# Altium project QUT_Autopilot_Pixracer.PrjPcb (part 2 of 2)

## Sheet pixracer_serials.SchDoc
size A4; SheetNumber: 4; SheetTotal: 5
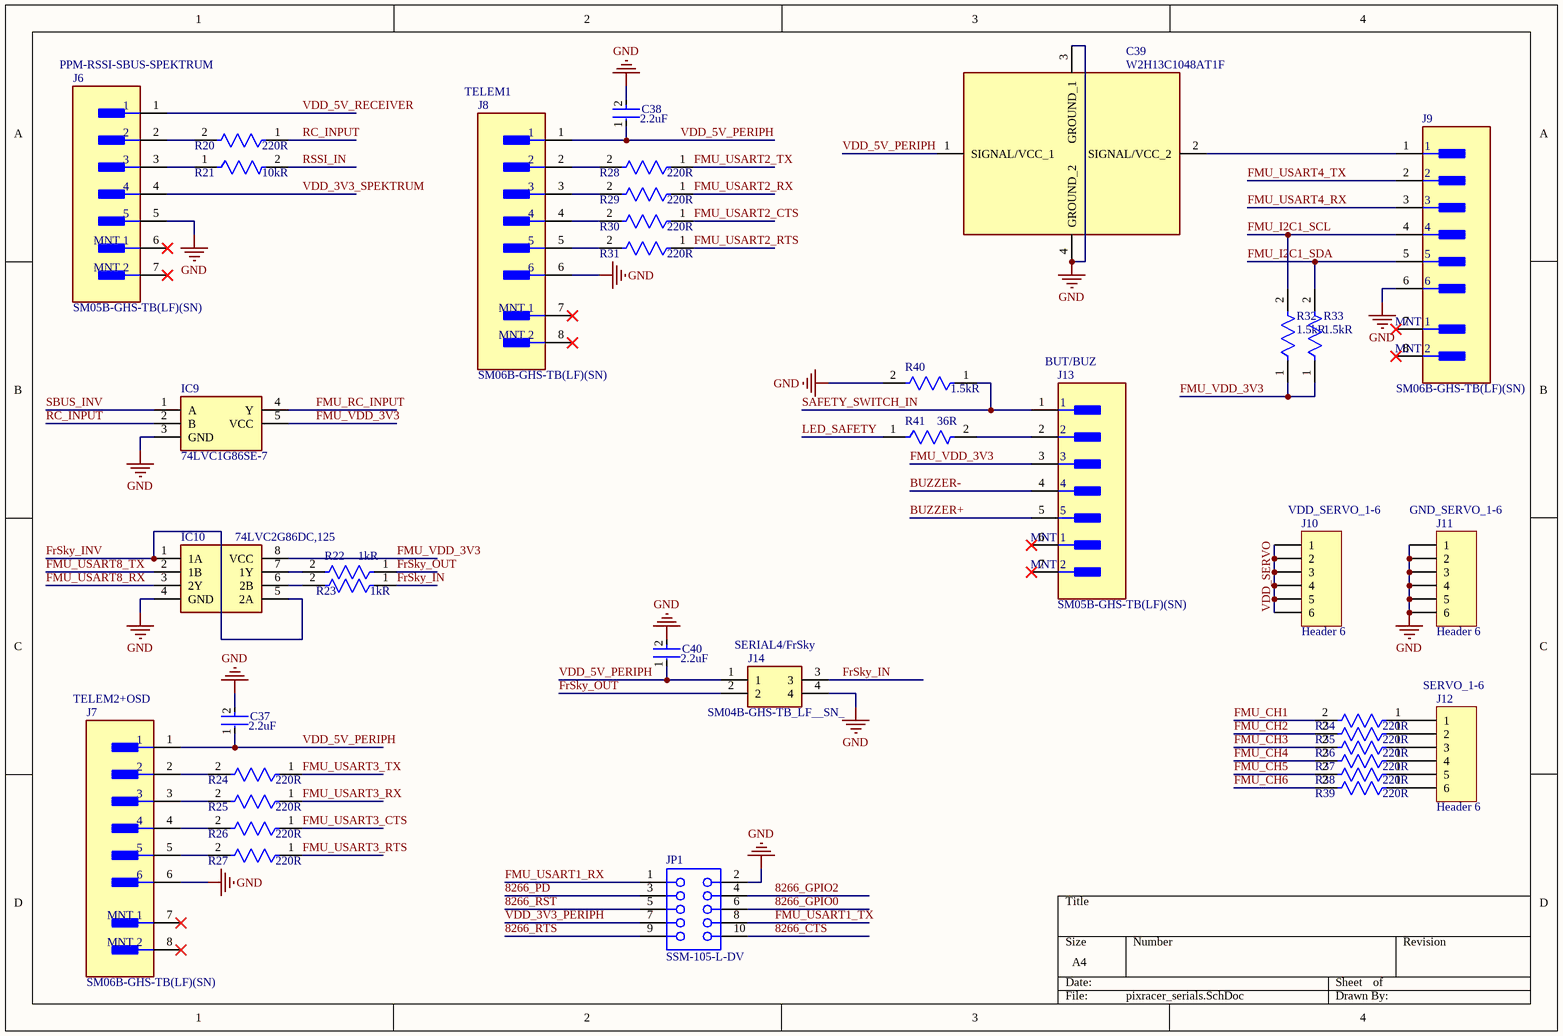
[diagram p3: pixracer_serials.SchDoc]

### Parts
C37  Capacitance: 2.2uF  [FP-C1608-080-0_1-MFG]  (hidden comment: C1608X7R1A225K080AC)
C38  Capacitance: 2.2uF  [FP-C1608-080-0_1-MFG]  (hidden comment: C1608X7R1A225K080AC)
C39  W2H13C1048AT1F  [W2H13C1048AT1A]
C40  Capacitance: 2.2uF  [FP-C1608-080-0_1-MFG]  (hidden comment: C1608X7R1A225K080AC)
IC9  74LVC1G86SE-7  [SOT65P210X110-5N]
IC10  74LVC2G86DC,125  [SOP50P310X100-8N]
J6  SM05B-GHS-TB(LF)(SN)  [FP-SM05B-GHS-TB_LF_SN-MFG]
J7  SM06B-GHS-TB(LF)(SN)  [FP-SM06B-GHS-TB_LF_SN-MFG]
J8  SM06B-GHS-TB(LF)(SN)  [FP-SM06B-GHS-TB_LF_SN-MFG]
J9  SM06B-GHS-TB(LF)(SN)  [FP-SM06B-GHS-TB_LF_SN-MFG]
J10  Header 6  [HDR1X6]
J11  Header 6  [HDR1X6]
J12  Header 6  [HDR1X6]
J13  SM05B-GHS-TB(LF)(SN)  [FP-SM05B-GHS-TB_LF_SN-MFG]
J14  SM04B-GHS-TB_LF__SN_  [SM04B-GHS-TB]
JP1  SSM-105-L-DV  [SMTC-SSM-105-X-DV]
R20  Resistance: 220R  [FP-CRCW0603-e3-MFG]  (hidden comment: CRCW0603220RFKEB)
R21  Resistance: 10kR  [FP-ERJ3G-IPC_C]  (hidden comment: ERJ-3GEYJ103V)
R22  Resistance: 1kR  [FP-RC1608-IPC_A]  (hidden comment: RC1608J102CS)
R23  Resistance: 1kR  [FP-RC1608-IPC_A]  (hidden comment: RC1608J102CS)
R24  Resistance: 220R  [FP-CRCW0603-e3-MFG]  (hidden comment: CRCW0603220RFKEB)
R25  Resistance: 220R  [FP-CRCW0603-e3-MFG]  (hidden comment: CRCW0603220RFKEB)
R26  Resistance: 220R  [FP-CRCW0603-e3-MFG]  (hidden comment: CRCW0603220RFKEB)
R27  Resistance: 220R  [FP-CRCW0603-e3-MFG]  (hidden comment: CRCW0603220RFKEB)
R28  Resistance: 220R  [FP-CRCW0603-e3-MFG]  (hidden comment: CRCW0603220RFKEB)
R29  Resistance: 220R  [FP-CRCW0603-e3-MFG]  (hidden comment: CRCW0603220RFKEB)
R30  Resistance: 220R  [FP-CRCW0603-e3-MFG]  (hidden comment: CRCW0603220RFKEB)
R31  Resistance: 220R  [FP-CRCW0603-e3-MFG]  (hidden comment: CRCW0603220RFKEB)
R32  value 1.5kR  [FP-CPF0603-MFG]  (hidden comment: CPF0603B1K5E1)
R33  value 1.5kR  [FP-CPF0603-MFG]  (hidden comment: CPF0603B1K5E1)
R34  Resistance: 220R  [FP-CRCW0603-e3-MFG]  (hidden comment: CRCW0603220RFKEB)
R35  Resistance: 220R  [FP-CRCW0603-e3-MFG]  (hidden comment: CRCW0603220RFKEB)
R36  Resistance: 220R  [FP-CRCW0603-e3-MFG]  (hidden comment: CRCW0603220RFKEB)
R37  Resistance: 220R  [FP-CRCW0603-e3-MFG]  (hidden comment: CRCW0603220RFKEB)
R38  Resistance: 220R  [FP-CRCW0603-e3-MFG]  (hidden comment: CRCW0603220RFKEB)
R39  Resistance: 220R  [FP-CRCW0603-e3-MFG]  (hidden comment: CRCW0603220RFKEB)
R40  Resistance: 1.5kR  [FP-MCR03-IPC_A]  (hidden comment: MCR03EZPFX1501)
R41  Resistance: 36R  [FP-CRCW0603-e3-IPC_B]  (hidden comment: CRCW060336R0JNEA)

### Nets
GND: C37.2 C38.2 C39.3(GROUND_1) C39.4(GROUND_2) C40.2 IC9.3(GND) IC10.4(GND) J6.5 J7.6 J8.6 J9.6 J11.1 J11.2 J11.3 J11.4 J11.5 J11.6 J14.4 JP1.2 R40.2
8266_CTS: JP1.10
8266_GPIO0: JP1.6
8266_GPIO2: JP1.4
8266_PD: JP1.3
8266_RST: JP1.5
8266_RTS: JP1.9
BUZZER+: J13.5
BUZZER-: J13.4
FMU_CH1: R34.2
FMU_CH2: R35.2
FMU_CH3: R36.2
FMU_CH4: R37.2
FMU_CH5: R38.2
FMU_CH6: R39.2
FMU_I2C1_SCL: J9.4 R32.2
FMU_I2C1_SDA: J9.5 R33.2
FMU_RC_INPUT: IC9.4(Y)
FMU_USART1_RX: JP1.1
FMU_USART1_TX: JP1.8
FMU_USART2_CTS: R30.1
FMU_USART2_RTS: R31.1
FMU_USART2_RX: R29.1
FMU_USART2_TX: R28.1
FMU_USART3_CTS: R26.1
FMU_USART3_RTS: R27.1
FMU_USART3_RX: R25.1
FMU_USART3_TX: R24.1
FMU_USART4_RX: J9.3
FMU_USART4_TX: J9.2
FMU_USART8_RX: IC10.3(2Y)
FMU_USART8_TX: IC10.2(1B)
FMU_VDD_3V3: IC9.5(VCC) IC10.8(VCC) J13.3 R32.1 R33.1
FrSky_IN: J14.3 R23.1
FrSky_INV: IC10.1(1A) IC10.5(2A)
FrSky_OUT: J14.2 R22.1
LED_SAFETY: R41.1
RC_INPUT: IC9.2(B) R20.1
RSSI_IN: R21.2
SAFETY_SWITCH_IN: J13.1 R40.1
SBUS_INV: IC9.1(A)
VDD_3V3_PERIPH: JP1.7
VDD_3V3_SPEKTRUM: J6.4
VDD_5V_PERIPH: C37.1 C38.1 C39.1(SIGNAL/VCC_1) C40.1 J7.1 J8.1 J14.1
VDD_5V_RECEIVER: J6.1
VDD_SERVO: J10.1 J10.2 J10.3 J10.4 J10.5 J10.6
NetC39_2: C39.2(SIGNAL/VCC_2) J9.1
NetIC10_6: IC10.6(2B) R23.2
NetIC10_7: IC10.7(1Y) R22.2
NetJ6_2: J6.2 R20.2
NetJ6_3: J6.3 R21.1
NetJ7_2: J7.2 R24.2
NetJ7_3: J7.3 R25.2
NetJ7_4: J7.4 R26.2
NetJ7_5: J7.5 R27.2
NetJ8_2: J8.2 R28.2
NetJ8_3: J8.3 R29.2
NetJ8_4: J8.4 R30.2
NetJ8_5: J8.5 R31.2
NetJ12_1: J12.1 R34.1
NetJ12_2: J12.2 R35.1
NetJ12_3: J12.3 R36.1
NetJ12_4: J12.4 R37.1
NetJ12_5: J12.5 R38.1
NetJ12_6: J12.6 R39.1
NetJ13_2: J13.2 R41.2

Not connected (* = marked no-connect by the designer): J6 6(MNT_1)* 7(MNT_2)*; J7 7(MNT_1)* 8(MNT_2)*; J8 7(MNT_1)* 8(MNT_2)*; J9 7(MNT_1)* 8(MNT_2)*; J13 6(MNT_1)* 7(MNT_2)*

### Notes on the sheet
- (near J6) PPM-RSSI-SBUS-SPEKTRUM
- TELEM1
- (near J13) BUT/BUZ
- (near J10) VDD_SERVO_1-6
- (near J11) GND_SERVO_1-6
- (near J14) SERIAL4/FrSky
- (near J7) TELEM2+OSD
- (near J12) SERVO_1-6

### Library data of the parts
C37 C38 C40 = CMP-08246-006835-1: Multilayer Ceramic Capacitors 2.2μF ±10% 10V X7R SMD 0603; Lead Free: Lead Free; Mount: Surface Mount; Case Code (Metric): 1608; Construction: Flat; Packaging: Tape and Reel; REACH SVHC: No SVHC; Weight: 7.1E-05oz; Resistor Type: Ceramic; Package Quantity: 4000; Voltage Rating (DC): 10V; Case/Package: 0603; Termination: SMD/SMT; Case Code (Imperial): 0603; Series: C; Voltage Rating: 10V; Min Operating Temperature: -55°C; Dielectric Material: Ceramic; Length: 1.6mm; Tolerance: 10%; Depth: 0.8mm; Width: 0.031inch; Dielectric: X7R; Max Operating Temperature: 125°C; RoHS Compliant: Yes; Height: 0.8mm; Thickness: 0.037inch
C39 = W2H13C1048AT1F: Capacitor; Manufacturer_Name: AVX; Datasheet Link: https://componentsearchengine.com/Datasheets/1/W2H13C1048AT1F.pdf; Height: 1mm; Manufacturer_Part_Number: W2H13C1048AT1F; Mouser Part Number: 581-W2H13C1048AT1F; Mouser Price/Stock: https://www.mouser.com/Search/Refine.aspx?Keyword=581-W2H13C1048AT1F; Arrow Part Number: W2H13C1048AT1F; Arrow Price/Stock: https://www.arrow.com/en/products/w2h13c1048at1f/avx
IC9 = 74LVC1G86SE-7: Integrated Circuit; Manufacturer_Name: Diodes Inc.; Datasheet Link: https://www.diodes.com/assets/Datasheets/74LVC1G86.pdf; Height: 1.1mm; Manufacturer_Part_Number: 74LVC1G86SE-7; Mouser Part Number: 621-74LVC1G86SE-7; Mouser Price/Stock: https://www.mouser.co.uk/ProductDetail/Diodes-Incorporated/74LVC1G86SE-7/?qs=8Dv1RiiPiVJ%252BnYSWg3kTgg%3D%3D; Arrow Part Number: 74LVC1G86SE-7; Arrow Price/Stock: https://www.arrow.com/en/products/74lvc1g86se-7/diodes-incorporated?region=nac
IC10 = 74LVC2G86DC,125: Integrated Circuit; Manufacturer_Name: Nexperia; Datasheet Link: https://assets.nexperia.com/documents/data-sheet/74LVC2G86.pdf; Height: 1mm; Manufacturer_Part_Number: 74LVC2G86DC,125; Mouser Part Number: 771-LVC2G86DC125; Mouser Price/Stock: https://www.mouser.co.uk/ProductDetail/Nexperia/74LVC2G86DC125?qs=me8TqzrmIYXbZy3sMRjHUw%3D%3D; Arrow Part Number: 74LVC2G86DC,125; Arrow Price/Stock: https://www.arrow.com/en/products/74lvc2g86dc125/nexperia?region=nac
J6 J13 = CMP-17439-000048-1: CONN HEADER SMD R/A 5POS 1.25MM; Current Rating: 1A; Pitch: 0.049inch; Connector Type: Outer Shroud Contact; Number of Positions: 5; Voltage Rating (AC): 50V; Wire/Cable Gauge: 26AWG; Series: GH; Mount: Surface Mount; Housing Material: Nylon; Contact Type: Outer Shroud Contact; REACH SVHC: No SVHC; Number of Rows: 1; Lead Free: Lead Free; Color: Natural; Contact Material: Bronze; Contact Plating: Tin; Max Operating Temperature: 85°C; Orientation: Right Angle; Number of Contacts: 5; Voltage Rating: 50V; Housing Color: Natural; Termination: Solder; Min Operating Temperature: -25°C; Fastening Type: Ramp; Packaging: Tape and Reel
J7-J9 = CMP-17439-000061-1: CONN HEADER SMD R/A 6POS 1.25MM; Number of Contacts: 6; Voltage Rating: 50V; Current Rating: 1A; Connector Type: Outer Shroud Contact; Contact Resistance: 50mR; Orientation: Right Angle; Max Operating Temperature: 85°C; Mount: Surface Mount; Packaging: Tape and Reel; Contact Plating: Tin; Depth: 4.05mm; Max Voltage Rating (AC): 50V; Lead Free: Lead Free; Pitch: 1.25mm; Number of Positions: 6; Max Current Rating: 1A; Termination: Solder; Min Operating Temperature: -25°C; Housing Color: Beige; Fastening Type: Ramp; Length: 10.75mm; Color: Natural; Contact Material: Bronze; Housing Material: Polyamide; Number of Rows: 1
J10-J12 = Header 6: Header, 6-Pin; LatestRevisionDate: 17-Jul-2002; LatestRevisionNote: Re-released for DXP Platform.; Publisher: Altium Limited
J14 = SM04B-GHS-TB_LF__SN_: Connector; Manufacturer_Name: JST (JAPAN SOLDERLESS TERMINALS); Manufacturer_Part_Number: SM04B-GHS-TB(LF)(SN); Datasheet Link: http://uk.rs-online.com/web/p/products/7521797
JP1 = CMP-1023-00207-1: Tiger Claw(TM) Surface Mount Socket, Vertical, -55 to 125 degC, 2.54 mm Pitch, 10-Pin, Female, RoHS; Manufacturer: Samtec; Pitch: 2.54 mm; PackageReference: SSM-105-X-DV; DatasheetVersion: F-214; ComponentLink2Description: Datasheet; Mounting Technology: Surface Mount; PackageDescription: .100 C.L. Double Vertical SMT Socket Strip; ComponentLink3Description: Package Specification; ComponentLink2URL: http://www.samtec.com/documents/webfiles/pdf/SSM_SM.PDF; ComponentLink1URL: http://www.samtec.com; PackageVersion: AK, 3/2000; Orientation: Vertical; RoHS: True; ComponentLink1Description: Manufacturer URL; PartNumber: SSM-105-L-DV; ComponentLink3URL: http://www.samtec.com/documents/webfiles/cpdf/SSM-1XX-XXX-DV-XX-XX-X-XX-MKT.pdf; Temperature Range: -55 to 125 degC
R20 R24-R31 R34-R39 = CMP-02407-003555-1: RES Thick Film, 220Ω, 1%, 0.1W, 100ppm/°C, 0603; Voltage Rating: 75V; Power Rating: 100mW; Length: 1.55mm; Weight: 7.1E-05oz; Package Quantity: 10000; Case/Package: 0603; Composition: Thick Film; Max Operating Temperature: 155°C; Military Standard: Not; Tolerance: 1%; Lead Free: Lead Free; Number of Terminations: 2; Min Operating Temperature: -55°C; Case Code (Imperial): 0603; Max Power Dissipation: 100mW; Features: Automotive AEC-Q200; Packaging: Tape and Reel; Temperature Coefficient: 100ppm/°C; Case Code (Metric): 1608; Termination: SMD/SMT; Depth: 0.85mm; Height: 0.02inch; Width: 0.85mm
R21 = CMP-2000-00704-2: RES SMD 10K OHM 5% 1/10W 0603; Temperature Coefficient: 200ppm/°C; Max Power Dissipation: 100mW; Voltage Rating (DC): 50V; Voltage Rating: 75V; Resistor Type: Thick Film; Tolerance: 5%; Military Standard: Not; Package Quantity: 1; Max Operating Temperature: 155°C; Mount: Surface Mount; Technology: THICK FILM; Case/Package: 0603; Construction: Rectangular; Depth: 0.8mm; Case Code (Imperial): 0603; Weight: 7.1E-05oz; Features: Automotive AEC-Q200; Packaging: Tape and Reel; Width: 0.8mm; Length: 1.6mm; Termination: SMD/SMT; Power Rating: 100mW; Lead Free: Lead Free; Number of Terminations: 2; Height: 0.45mm; RoHS Compliant: Yes; Min Operating Temperature: -55°C; Contact Plating: Tin; REACH SVHC: No SVHC; Resistance Tolerance: 5%; Series: ERJ; Working Voltage: 75V; Case Code (Metric): 1608
R22 R23 = CMP-13261-002301-1: Res Thick Film 0603 1kΩ 5% 0.1W ±100ppm/°C Molded SMD T/R; Power Rating: 100mW; Voltage Rating (DC): 50V; Contact Plating: Tin; Mount: Surface Mount; Number of Terminations: 2; Features: Moisture Resistant; Max Power Dissipation: 100mW; Military Standard: Not; Case/Package: 0603; Radiation Hardening: No; Temperature Coefficient: 100ppm/°C; Length: 1.6mm; Height: 0.022inch; Case Code (Metric): 1608; Max Operating Temperature: 155°C; Composition: Thick Film; Tolerance: 5%; Width: 0.031inch; Depth: 0.8mm; Packaging: Tape and Reel; Lead Free: Lead Free; Case Code (Imperial): 0603; Min Operating Temperature: -55°C
R32 R33 = CMP-03211-005433-1: RES SMD 1.5KΩ 0.1% 1/16W 0603; Manufacturer: TE Connectivity; Power Rating: 0.063W; Voltage Rating: 50V; Temperature Coefficient: 25ppm/°C; Series: CPF; Temperature Range Low: -55°C; ComponentLink2URL: https://www.te.com/commerce/DocumentDelivery/DDEController?Action=showdoc&DocId=Data+Sheet%7F1773200%7FM%7Fpdf%7FEnglish%7FENG_DS_1773200_M.pdf%7F3-1676481-2; Height: 0.55mm; Lead Free: Yes; Resistance: 1.5KΩ; RoHS: TRUE; Device Class L1: Passive Components; Manufacturer Part Number: CPF0603B1K5E1; Octopart: https://octopart.com/cpf0603b1k5e1-te+connectivity-9539421; Package: CPF0603; Device Class L3: Chip SMD Resistors; packaging: 1k Reel; Tolerance: 0.1%; octopart_url: https://octopart.com/cpf0603b1k5e1-te+connectivity-9539421; Temperature: -55°C to +155°C; Automotive: No; Device Class L2: Resistors; Composition: Thin Film; Ipc Land Pattern Name: RESC15580X45; ComponentLink2Description: Datasheet; Category: Res; Temperature Range High: +155°C
R40 = CMP-08839-007837-1: Thick Film Chip Resistor, 0603, 1.5kΩ, 1%, 100ppm/°C, 0.1W, 50V; Max Power Dissipation: 100mW; Package Quantity: 5000; Case/Package: 0603; Max Operating Temperature: 155°C; Power Rating: 100mW; Voltage Rating (DC): 50V; Features: Automotive AEC-Q200; Mount: Surface Mount; Min Operating Temperature: -55°C; Military Standard: Not; Depth: 0.8mm; Case Code (Imperial): 0603; Number of Terminations: 2; Tolerance: 1%; Width: 0.031inch; Lead Free: Lead Free; Case Code (Metric): 1608; Temperature Coefficient: 100ppm/°C; Resistor Type: Thick Film; RoHS Compliant: Yes; Length: 0.063inch; Height: 0.022inch; Packaging: Tape and Reel
R41 = CMP-2000-03274-2: RES Thick Film, 36Ω, 5%, 0.1W, 200ppm/°C, 0603; Power Rating: 100mW; Voltage Rating (DC): 75V; Min Operating Temperature: -55°C; Lead Free: Lead Free; Width: 0.033inch; Case Code (Metric): 1608; Max Operating Temperature: 155°C; Packaging: Tape and Reel; Temperature Coefficient: 200ppm/°C; Features: Automotive AEC-Q200; Case Code (Imperial): 0603; Case/Package: 0603; Weight: 7.1E-05oz; Composition: Thick Film; Max Power Dissipation: 100mW; Radiation Hardening: No; Number of Terminations: 2; Height: 0.02inch; Package Quantity: 1; Contact Plating: Tin; Voltage Rating: 75V; Length: 0.061inch; Tolerance: 5%

## Sheet pixracer_power.SchDoc
size A4; SheetNumber: 5; SheetTotal: 5
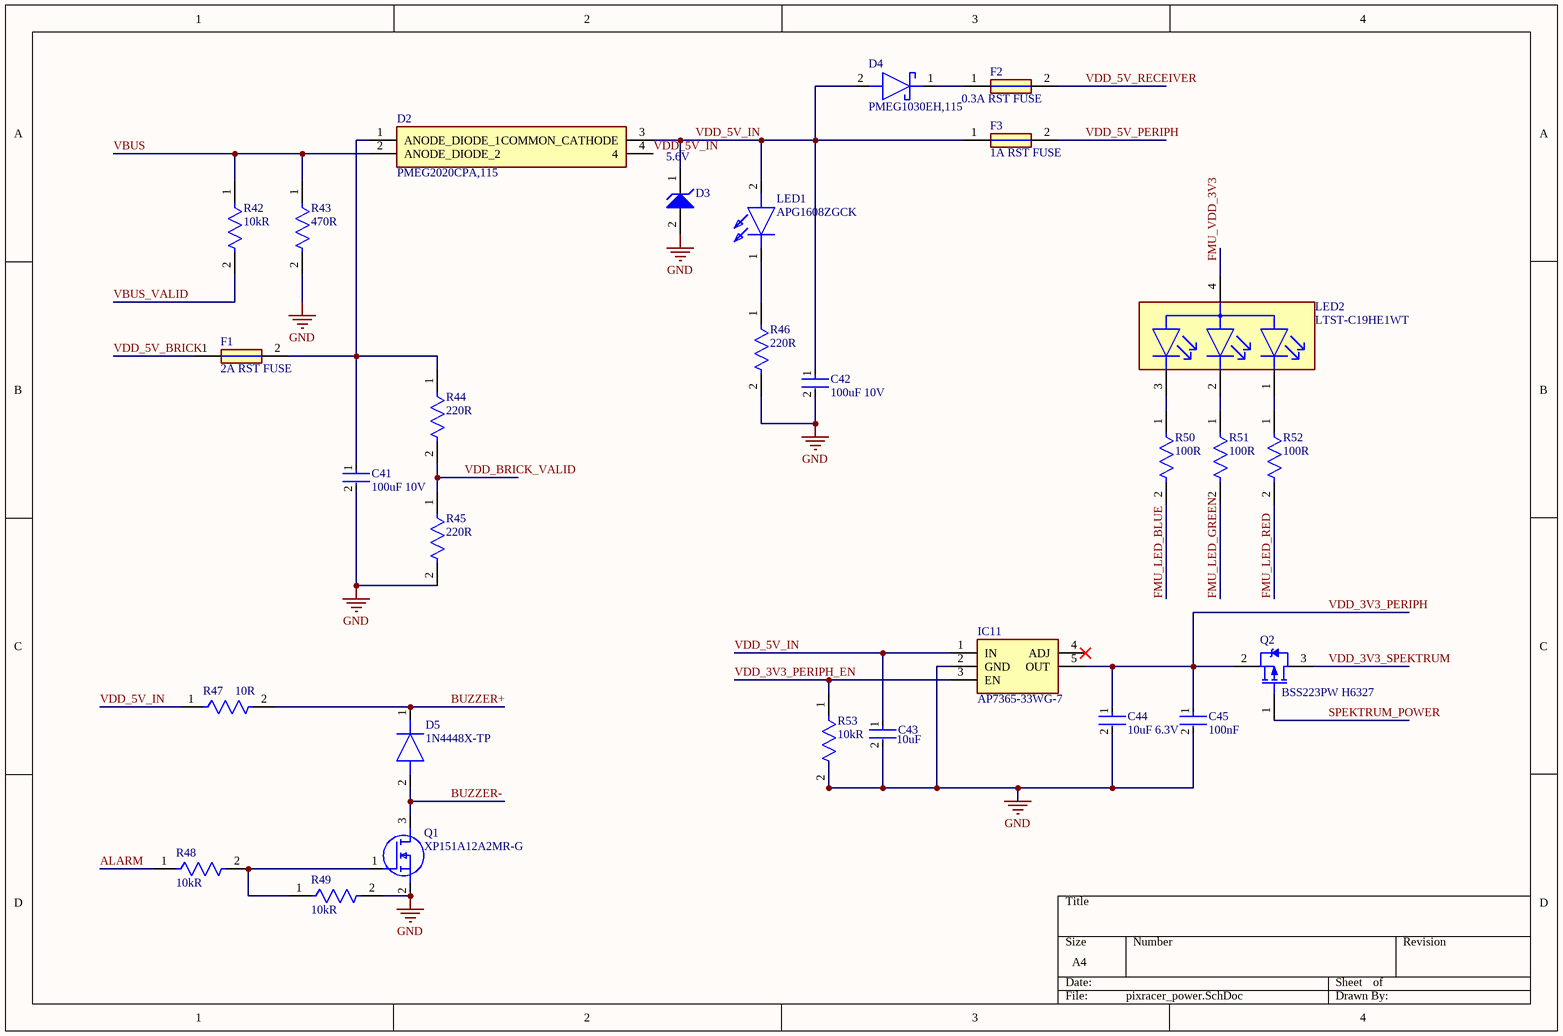
[diagram p4: pixracer_power.SchDoc]

### Parts
C41  Capacitance: 100uF 10V  [FP-C3216-160-0_3-IPC_C]  (hidden comment: C3216X5R1A107M160AC)
C42  Capacitance: 100uF 10V  [FP-C3216-160-0_3-IPC_C]  (hidden comment: C3216X5R1A107M160AC)
C43  Capacitance: 10uF  [FP-CL10-IPC_B]  (hidden comment: CL10A106KP8NNND)
C44  Capacitance: 10uF 6.3V  [FP-CC0603-0_15-0_95-IPC_B]  (hidden comment: CC0603KRX5R5BB106)
C45  Capacitance: 100nF  [FP-0603-L_1_6_0_15-W_0_81-IPC_B]  (hidden comment: 0603ZC104MAT2A)
D2  PMEG2020CPA,115  [PMEG2020CPA115]
D3  VZ Typ (V): 5.6V  [ONSC-SOD-123-2-425-04_V]  (hidden comment: MMSZ5232BT1G)
D4  PMEG1030EH,115  [SODFL3516X120N]
D5  1N4448X-TP  [1N4448XTP]
F1  value 2A RST FUSE  [FUSC3216X100N]  (hidden comment: 0ZCJ0100FF2E)
F2  value 0.3A RST FUSE  [FUSC2214X75N]  (hidden comment: 0ZCK0035FF2G)
F3  value 1A RST FUSE  [FUSC3216X100N]  (hidden comment: 0ZCJ0100FF2E)
IC11  AP7365-33WG-7  [SOT95P285X130-5N]
LED1  APG1608ZGCK  [LEDC1608X28N]
LED2  LTST-C19HE1WT  [FP-LTST-C19HE1WT-MFG]
Q1  XP151A12A2MR-G  [SOT95P280X130-3N]
Q2  BSS223PW H6327  [INF-PG-SOT-323_N]
R42  Resistance: 10kR  [FP-ERJ3G-IPC_C]  (hidden comment: ERJ-3GEYJ103V)
R43  Resistance: 470R  [FP-CRCW0603-e3-IPC_A]  (hidden comment: CRCW0603470RJNEA)
R44  Resistance: 220R  [FP-CRCW0603-e3-MFG]  (hidden comment: CRCW0603220RFKEB)
R45  Resistance: 220R  [FP-CRCW0603-e3-MFG]  (hidden comment: CRCW0603220RFKEB)
R46  Resistance: 220R  [FP-CRCW0603-e3-MFG]  (hidden comment: CRCW0603220RFKEB)
R47  value 10R  [FP-RT0603-MFG]  (hidden comment: RT0603BRD0710RL)
R48  Resistance: 10kR  [FP-ERJ3G-IPC_C]  (hidden comment: ERJ-3GEYJ103V)
R49  Resistance: 10kR  [FP-ERJ3G-IPC_C]  (hidden comment: ERJ-3GEYJ103V)
R50  Resistance: 100R  [FP-CRCW0603-e3-IPC_A]  (hidden comment: CRCW0603100RFKEB)
R51  Resistance: 100R  [FP-CRCW0603-e3-IPC_A]  (hidden comment: CRCW0603100RFKEB)
R52  Resistance: 100R  [FP-CRCW0603-e3-IPC_A]  (hidden comment: CRCW0603100RFKEB)
R53  Resistance: 10kR  [FP-ERJ3G-IPC_C]  (hidden comment: ERJ-3GEYJ103V)

### Nets
GND: C41.2 C42.2 C43.2 C44.2 C45.2 D3.2(A) IC11.2(GND) Q1.2(S) R43.2 R45.2 R46.2 R49.2 R53.2
ALARM: R48.1
BUZZER+: D5.1(K) R47.2
BUZZER-: D5.2(A) Q1.3(D)
FMU_LED_BLUE: R50.2
FMU_LED_GREEN: R51.2
FMU_LED_RED: R52.2
FMU_VDD_3V3: LED2.4(A)
SPEKTRUM_POWER: Q2.1(GATE)
VBUS: D2.2(ANODE_DIODE_2) R42.1 R43.1
VBUS_VALID: R42.2
VDD_3V3_PERIPH: C44.1 C45.1 IC11.5(OUT) Q2.2(SOURCE)
VDD_3V3_PERIPH_EN: IC11.3(EN) R53.1
VDD_3V3_SPEKTRUM: Q2.3(DRAIN)
VDD_5V_BRICK: F1.1
VDD_5V_IN: C42.1 C43.1 D2.3(COMMON_CATHODE) D2.4 D3.1(K) D4.2(A) F3.1 IC11.1(IN) LED1.2(A) R47.1
VDD_5V_PERIPH: F3.2
VDD_5V_RECEIVER: F2.2
VDD_BRICK_VALID: R44.2 R45.1
NetC41_1: C41.1 D2.1(ANODE_DIODE_1) F1.2 R44.1
NetD4_1: D4.1(K) F2.1
NetLED1_1: LED1.1(K) R46.1
NetLED2_1: LED2.1(RED_C) R52.1
NetLED2_2: LED2.2(GREEN_C) R51.1
NetLED2_3: LED2.3(BLUE_C) R50.1
NetQ1_1: Q1.1(G) R48.2 R49.1

Not connected (* = marked no-connect by the designer): IC11 4(ADJ)*

### Library data of the parts
C41 C42 = CMP-2000-05396-3: Multilayer Ceramic Capacitors 100uF ±20% 10V X5R SMD 1206; Voltage Rating (DC): 10V; Length: 3.2mm; Mount: Surface Mount; Depth: 1.6mm; Width: 1.6mm; Package Quantity: 1; Min Operating Temperature: -55°C; Packaging: Tape and Reel; Max Operating Temperature: 85°C; Dielectric: X5R; Construction: Flat; Case Code (Imperial): 1206; Thickness: 0.075inch; Radiation Hardening: No; RoHS Compliant: Yes; Series: C; Dielectric Material: Ceramic; Voltage: 10V; REACH SVHC: No SVHC; Case Code (Metric): 3216; Weight: 0.000571oz; Height: 1.6mm; Voltage Rating: 10V; Termination: SMD/SMT; Lead Free: Lead Free; Tolerance: 20%; Case/Package: 1206; Resistor Type: Ceramic
C43 = CMP-13271-003245-1: Cap Ceramic 10uF 10V X5R ±10% Pad SMD 0603 +85°C T/R; Packaging: Tape and Reel; Dielectric: X5R; Min Operating Temperature: -55°C; Lead Free: Lead Free; Height: 0.8mm; Package Quantity: 10000; Voltage Rating (DC): 10V; Mount: Surface Mount; Tolerance: 10%; Width: 0.031inch; Thickness: 0.035inch; Depth: 0.8mm; Max Operating Temperature: 85°C; Case/Package: 0603; Length: 1.6mm; Voltage Rating: 10V; Radiation Hardening: No
C44 = CMP-03422-001506-1: CAP CER 10UF 6.3V X5R 0603; Tolerance: 20%; Voltage: 4V; Depth: 0.8mm; Halogen Free: Halogen Free; Case Code (Metric): 1608; Height: 0.8mm; Voltage Rating (DC): 6.3V; Construction: Flat; Series: CC; Lead Free: Lead Free; Min Operating Temperature: -55°C; Thickness: 0.035inch; Max Operating Temperature: 85°C; Termination: SMD/SMT; Length: 1.6mm; Resistor Type: Ceramic; Dielectric: X5R; Mount: Surface Mount; Width: 0.031inch; Case/Package: 0603; Packaging: Tape and Reel; Case Code (Imperial): 0603; Voltage Rating: 6.3V; Weight: 7.1E-05oz; Radiation Hardening: No; RoHS Compliant: Yes
C45 = CMP-2006-04550-2: General Purpose Ceramic Capacitor, 0603, 100nF, 20%, X7R, 15%, 10V; Mount: Surface Mount; Package Quantity: 4000; RoHS Compliant: Yes; Case Code (Imperial): 0603; Voltage Rating: 10V; Packaging: Tape and Reel; Series: -; Tolerance: 20%; Thickness: 0.035inch; Number of Pins: 2; Min Operating Temperature: -55°C; Case/Package: 0603; Length: 1.6mm; Radiation Hardening: No; Voltage Rating (DC): 10V; Depth: 0.81mm; Lead Pitch: 0.014inch; Termination: SMD/SMT; Case Code (Metric): 1608; Construction: Flat; Width: 0.032inch; Lead Free: Lead Free; Max Operating Temperature: 125°C; Dielectric: X7R
D2 = PMEG2020CPA,115: Schottky Diode; Manufacturer_Name: Nexperia; Datasheet Link: https://assets.nexperia.com/documents/data-sheet/PMEG2020CPA.pdf; Height: 0.65mm; Manufacturer_Part_Number: PMEG2020CPA,115; Mouser Part Number: 771-PMEG2020CPA115; Mouser Price/Stock: https://www.mouser.co.uk/ProductDetail/Nexperia/PMEG2020CPA115?qs=O%2F7ihdSJpebmoeJaQpZU%2FA%3D%3D; Arrow Part Number: PMEG2020CPA,115; Arrow Price/Stock: https://www.arrow.com/en/products/pmeg2020cpa115/nexperia
D3 = CMP-1060-00586-1: Zener Voltage Regulator, 500 mW, 2-Pin SOD-123, Pb-Free, Tape and Reel; Manufacturer: On Semiconductor; P Max (W): 0.5; ComponentLink3URL: http://www.onsemi.com/pub_link/Collateral/425-04.PDF; Packing: Tape and Reel; ComponentLink3Description: Package Specification; ComponentLink2URL: http://www.onsemi.com/pub_link/Collateral/MMSZ5221BT1-D.PDF; ComponentLink1URL: http://www.onsemi.com/; ComponentLink2Description: Datasheet; PackageReference: SOD-123-2-425-04; ComponentLink1Description: Manufacturer URL; PartNumber: MMSZ5232BT1G; PackageVersion: Rev. G, 10/2009; PackageDescription: 2-Pin SOD, Body 1.6 x 2.69 mm; Mounting Technology: Surface Mount; RoHS: Pb-Free; DatasheetVersion: Rev. 12
D4 = PMEG1030EH,115: Schottky Diode; Manufacturer_Name: NXP; Datasheet Link: https://assets.nexperia.com/documents/data-sheet/PMEG1030EH_EJ.pdf; Height: 1.2mm; Manufacturer_Part_Number: PMEG1030EH,115
D5 = 1N4448X-TP: Diode; Manufacturer_Name: Micro Commercial Components (MCC); Datasheet Link: https://www.mccsemi.com/pdf/Products/1N4448X(SOD-523).PDF; Height: 0.65mm; Manufacturer_Part_Number: 1N4448X-TP; Mouser Part Number: 833-1N4448X-TP; Mouser Price/Stock: https://www.mouser.co.uk/ProductDetail/Micro-Commercial-Components-MCC/1N4448X-TP?qs=0RDYWt4CO4fFI8HfN%2F4aEA%3D%3D; Arrow Part Number: 1N4448X-TP; Arrow Price/Stock: https://www.arrow.com/en/products/1n4448x-tp/micro-commercial-components?region=europe
F1 F3 = 0ZCJ0100FF2E: Fuse; Manufacturer_Name: Bel; Datasheet Link: https://eu.mouser.com/datasheet/2/643/0ZCJ_Nov2016-1132002.pdf; Height: 1mm; Manufacturer_Part_Number: 0ZCJ0100FF2E; Mouser Part Number: 530-0ZCJ0100FF2E
F2 = 0ZCK0035FF2G: Fuse; Manufacturer_Name: Bel; Datasheet Link: https://www.mouser.se/datasheet/2/643/0ZCK_Nov2016-1135081.pdf; Height: 0.75mm; Manufacturer_Part_Number: 0ZCK0035FF2G; Mouser Part Number: 530-0ZCK0035FF2G
IC11 = AP7365-33WG-7: Integrated Circuit; Manufacturer_Name: Diodes Inc.; Datasheet Link: https://componentsearchengine.com/Datasheets/1/AP7365-33WG-7.pdf; Height: 1.3mm; Manufacturer_Part_Number: AP7365-33WG-7; Mouser Part Number: 621-AP7365-33WG-7; Mouser Price/Stock: https://www.mouser.co.uk/ProductDetail/Diodes-Incorporated/AP7365-33WG-7?qs=abZ1nkZpTuOZFvxvoFPL0w%3D%3D; Arrow Part Number: AP7365-33WG-7; Arrow Price/Stock: https://www.arrow.com/en/products/ap7365-33wg-7/diodes-incorporated?region=nac
LED1 = APG1608ZGCK: LED; Manufacturer_Name: Kingbright; Datasheet Link: http://www.kingbrightusa.com/images/catalog/SPEC/APG1608ZGCK.pdf; Height: 0.28mm; Manufacturer_Part_Number: APG1608ZGCK; Mouser Part Number: 604-APG1608ZGCK; Mouser Price/Stock: https://www.mouser.co.uk/ProductDetail/Kingbright/APG1608ZGCK?qs=Oo40KB9lBTmmOma0ledTcg%3D%3D; Arrow Part Number: APG1608ZGCK; Arrow Price/Stock: https://www.arrow.com/en/products/apg1608zgck/kingbright
LED2 = CMP-2000-05201-2: LED RGB DIFFUSED CHIP SMD; Number of LEDs: 3; Test Current: 20mA; Luminous Intensity: 180mcd; Lens Color: White; Dominant Wavelength: 470nm; Color: Blue; Reverse Voltage: 5V; Viewing Angle: 130°; Forward Voltage: 3.35V; Max Operating Temperature: 80°C; Packaging: Tape and Reel; Lens Transparency: Diffused; Width: 1.6mm; Case Code (Metric): 1616; Height: 0.35mm; Lens Style: Diffused; Mount: Surface Mount; Package Quantity: 3000; Radiation Hardening: No; Length: 1.6mm; Case/Package: 0606; Forward Current: 20mA; Case Code (Imperial): 0606; Lead Free: Lead Free; Min Operating Temperature: -20°C; Number of Elements: 3; Number of Pins: 4; Depth: 1.6mm
Q1 = XP151A12A2MR-G: MOSFET (N-Channel); Manufacturer_Name: Torex; Datasheet Link: https://www.torexsemi.com/file/xp151a12a2mr/XP151A12A2MR.pdf; Height: 1.3mm; Manufacturer_Part_Number: XP151A12A2MR-G; Mouser Part Number: 865-XP151A12A2MR-G; Mouser Price/Stock: https://www.mouser.co.uk/ProductDetail/Torex-Semiconductor/XP151A12A2MR-G?qs=AsjdqWjXhJ%252BYt8dSaKx3TA%3D%3D
Q2 = CMP-1099-00033-1: P-Channel OptiMOS P Small-Signal-Transistor, -20 V VDS, -0.39 A ID, -55 to 150 degC, PG-SOT-323, Reel, Green; Manufacturer: Infineon; RDS (on) (max) (@4.5V): 1,200Â mOhm; Pto t (max): 0.25Â W; VGS(th) (min): -0.6Â V; ID (max): -0.39Â A; VGS(th) (max): -1.2Â V; RDS (on) (max): 2,100Â mOhm; IDpuls (max): -1.56Â A; QG: -0.5Â nC; VDS (max): -20Â V; Rth: 500Â K/W; Green: TRUE; Mounting Technology: Surface Mount; PackageReference: PG-SOT-323; ComponentLink3Description: Package Specification; ComponentLink3URL: http://www.infineon.com/dgdl/SOT323-Package_Overview.pdf?folderId=db3a30431936bc4b0119533e1dcb3c92&fileId=db3a30431936bc4b011953495f283cb1; DatasheetVersion: Rev. 1.5; PackageDescription: 3-Pin Small Outline Transistor Package, 2 x 1.25 mm Body, 0.65 mm Pitch; ComponentLink1Description: Manufacturer URL; ComponentLink2URL: http://www.infineon.com/dgdl/BSS223PW_Rev1.5.pdf?folderId=db3a304314dca38901154a72e3951a65&fileId=db3a3043321e49940132481523b6245f; Halogen-free: TRUE; ComponentLink1URL: http://www.infineon.com/; ComponentLink2Description: Datasheet; Packing: Reel; PartNumber: BSS223PW H6327; RDS (on) (max) (@2.5V): 2,100Â mOhm; PackageVersion: Apr-08
R42 R48 R49 R53 = CMP-2000-00704-2: as R21 on sheet pixracer_serials; Resistor Type: Thick Film; Tolerance: 5%; Military Standard: Not; Package Quantity: 1; Max Operating Temperature: 155°C; Mount: Surface Mount; Technology: THICK FILM; Case/Package: 0603; Construction: Rectangular; Depth: 0.8mm; Case Code (Imperial): 0603; Weight: 7.1E-05oz; Features: Automotive AEC-Q200; Packaging: Tape and Reel; Width: 0.8mm; Length: 1.6mm; Termination: SMD/SMT; Power Rating: 100mW; Lead Free: Lead Free; Number of Terminations: 2; Height: 0.45mm; RoHS Compliant: Yes; Min Operating Temperature: -55°C; Contact Plating: Tin; REACH SVHC: No SVHC; Resistance Tolerance: 5%; Series: ERJ; Working Voltage: 75V; Case Code (Metric): 1608
R43 = CMP-2000-03374-2: RES Thick Film, 470Ω, 5%, 0.1W, 200ppm/°C, 0603; Power Rating: 100mW; Voltage Rating: 75V; Case Code (Metric): 1608; Number of Terminations: 2; Min Operating Temperature: -55°C; Features: Automotive AEC-Q200; Military Standard: Not; Composition: Thick Film; Contact Plating: Tin; Case Code (Imperial): 0603; Package Quantity: 1; Mount: Surface Mount; Radiation Hardening: No; Depth: 0.85mm; Packaging: Tape and Reel; Length: 1.55mm; Termination: SMD/SMT; Weight: 7.1E-05oz; Max Operating Temperature: 155°C; Width: 0.033inch; Tolerance: 5%; Max Power Dissipation: 100mW; Height: 0.45mm; Case/Package: 0603; Temperature Coefficient: 200ppm/°C; Working Voltage: 75V
R44-R46 = CMP-02407-003555-1: as R20 on sheet pixracer_serials; Length: 1.55mm; Weight: 7.1E-05oz; Package Quantity: 10000; Case/Package: 0603; Composition: Thick Film; Max Operating Temperature: 155°C; Military Standard: Not; Tolerance: 1%; Lead Free: Lead Free; Number of Terminations: 2; Min Operating Temperature: -55°C; Case Code (Imperial): 0603; Max Power Dissipation: 100mW; Features: Automotive AEC-Q200; Packaging: Tape and Reel; Temperature Coefficient: 100ppm/°C; Case Code (Metric): 1608; Termination: SMD/SMT; Depth: 0.85mm; Height: 0.02inch; Width: 0.85mm
R47 = CMP-2000-04347-2: RES SMD 10 OHM 0.1% 1/10W 0603; Manufacturer: Yageo; Resistance: 10Ω; Temperature Coefficient: 25 ppm/°C; Power Rating: 0.1W; Tolerance: 0.001; Voltage Rating: 75V; Height: 0.55mm; Temperature Range Low: -55°C; Temperature Range High: +155°C; Package: RT0603; Digikey Description: RES SMD 10 OHM 0.1% 1/10W 0603; Lead Free: Yes; Ipc Land Pattern Name: RESC16080X45; Mouser Description: Thin Film Resistors - SMD 1/10W 10 ohm .1% 25ppm; Automotive: No; Footprint Url: http://www.yageo.com/exep/pages/download/literatures/PYu-R_Mount_10.pdf; Series: RT; Device Class L3: Chip SMD Resistors; Device Class L2: Resistors; Octopart: https://octopart.com/rt0603brd0710rl-yageo-1216748; Temperature: -55°C to +155°C; Manufacturer Part Number: RT0603BRD0710RL; Composition: Thin Film; Category: Res; ComponentLink2Description: Datasheet; Device Class L1: Passive Components; RoHS: TRUE; ComponentLink2URL: http://www.yageo.com/documents/recent/PYu-RT_1-to-0.01_RoHS_L_9.pdf
R50-R52 = CMP-2000-03825-2: RES Thick Film, 100Ω, 1%, 0.1W, 100ppm/°C, 0603; Voltage Rating (DC): 75V; Power Rating: 100mW; Case Code (Imperial): 0603; Case/Package: 0603; Composition: Thick Film; Military Standard: Not; Number of Terminations: 2; Packaging: Tape and Reel; Depth: 0.85mm; Height: 0.02inch; Features: Automotive AEC-Q200; Width: 0.033inch; Lead Free: Lead Free; Contact Plating: Tin; Package Quantity: 10000; Length: 1.55mm; Tolerance: 1%; Temperature Coefficient: 100ppm/°C; Max Operating Temperature: 155°C; Weight: 7.1E-05oz; Voltage Rating: 75V; Radiation Hardening: No; Max Power Dissipation: 100mW; Termination: SMD/SMT; Min Operating Temperature: -55°C; Case Code (Metric): 1608

## Nets that join several sheets
GND: pixracer_fmu (30 pins), pixracer_imu (36 pins), pixracer_sd_usb_can_i2c (21 pins), pixracer_serials (20 pins), pixracer_power (13 pins)
8266_CTS: pixracer_fmu (IC1.41), pixracer_serials (JP1.10)
8266_GPIO0: pixracer_fmu (IC1.1), pixracer_serials (JP1.6)
8266_GPIO2: pixracer_fmu (IC1.90), pixracer_serials (JP1.4)
8266_PD: pixracer_fmu (IC1.4), pixracer_serials (JP1.3)
8266_RST: pixracer_fmu (IC1.5), pixracer_serials (JP1.5)
8266_RTS: pixracer_fmu (IC1.67), pixracer_serials (JP1.9)
20608_CS: pixracer_fmu (IC1.9), pixracer_imu (IC5.5)
20608_DRDY: pixracer_fmu (IC1.8), pixracer_imu (IC5.6)
ALARM: pixracer_fmu (IC1.77), pixracer_power (R48.1)
BARO_CS: pixracer_fmu (IC1.88), pixracer_imu (IC6.5)
BATT_CURRENT_SENS: pixracer_fmu (IC1.26), pixracer_sd_usb_can_i2c (C33.1 R8.2)
BATT_VOLT_SENS: pixracer_fmu (IC1.25), pixracer_sd_usb_can_i2c (C34.1 R9.2)
BUZZER+: pixracer_serials (J13.5), pixracer_power (D5.1 R47.2)
BUZZER-: pixracer_serials (J13.4), pixracer_power (D5.2 Q1.3)
CAN1_RX: pixracer_fmu (IC1.81), pixracer_sd_usb_can_i2c (IC8.4)
CAN1_TX: pixracer_fmu (IC1.82), pixracer_sd_usb_can_i2c (IC8.1)
FMU_CH1: pixracer_fmu (IC1.45), pixracer_serials (R34.2)
FMU_CH2: pixracer_fmu (IC1.44), pixracer_serials (R35.2)
FMU_CH3: pixracer_fmu (IC1.42), pixracer_serials (R36.2)
FMU_CH4: pixracer_fmu (IC1.40), pixracer_serials (R37.2)
FMU_CH5: pixracer_fmu (IC1.60), pixracer_serials (R38.2)
FMU_CH6: pixracer_fmu (IC1.61), pixracer_serials (R39.2)
FMU_I2C1_SCL: pixracer_fmu (IC1.95), pixracer_serials (J9.4 R32.2)
FMU_I2C1_SDA: pixracer_fmu (IC1.96), pixracer_serials (J9.5 R33.2)
FMU_LED_BLUE: pixracer_fmu (IC1.89), pixracer_power (R50.2)
FMU_LED_GREEN: pixracer_fmu (IC1.36), pixracer_power (R51.2)
FMU_LED_RED: pixracer_fmu (IC1.48), pixracer_power (R52.2)
FMU_RC_INPUT: pixracer_fmu (IC1.64), pixracer_serials (IC9.4)
FMU_USART1_RX: pixracer_fmu (IC1.93), pixracer_serials (JP1.1)
FMU_USART1_TX: pixracer_fmu (IC1.92), pixracer_serials (JP1.8)
FMU_USART2_CTS: pixracer_fmu (IC1.84), pixracer_serials (R30.1)
FMU_USART2_RTS: pixracer_fmu (IC1.85), pixracer_serials (R31.1)
FMU_USART2_RX: pixracer_fmu (IC1.87), pixracer_serials (R29.1)
FMU_USART2_TX: pixracer_fmu (IC1.86), pixracer_serials (R28.1)
FMU_USART3_CTS: pixracer_fmu (IC1.58), pixracer_serials (R26.1)
FMU_USART3_RTS: pixracer_fmu (IC1.59), pixracer_serials (R27.1)
FMU_USART3_RX: pixracer_fmu (IC1.56), pixracer_serials (R25.1)
FMU_USART3_TX: pixracer_fmu (IC1.55), pixracer_serials (R24.1)
FMU_USART4_RX: pixracer_fmu (IC1.24), pixracer_serials (J9.3)
FMU_USART4_TX: pixracer_fmu (IC1.23), pixracer_serials (J9.2)
FMU_USART8_RX: pixracer_fmu (IC1.97), pixracer_serials (IC10.3)
FMU_USART8_TX: pixracer_fmu (IC1.98), pixracer_serials (IC10.2)
FMU_VDD_3V3: pixracer_fmu (11 pins), pixracer_sd_usb_can_i2c (C35.1 IC8.5 J4.4), pixracer_serials (5 pins), pixracer_power (LED2.4)
FRAM_MISO: pixracer_fmu (IC1.53 IC3.2), pixracer_imu (IC6.6)
FRAM_MOSI: pixracer_fmu (IC1.54 IC3.5), pixracer_imu (IC6.7)
FRAM_SCK: pixracer_fmu (IC1.47 IC3.6), pixracer_imu (IC6.8)
FrSky_INV: pixracer_fmu (IC1.69), pixracer_serials (IC10.1 IC10.5)
LED_SAFETY: pixracer_fmu (IC1.18), pixracer_serials (R41.1)
MPU9250_CS: pixracer_fmu (IC1.17), pixracer_imu (IC4.22)
MPU9250_DRDY: pixracer_fmu (IC1.62), pixracer_imu (IC4.12)
MPU9250_MISO: pixracer_fmu (IC1.31), pixracer_imu (IC4.9 IC5.4 U3.9)
MPU9250_MOSI: pixracer_fmu (IC1.32), pixracer_imu (IC4.24 IC5.3 U3.11)
MPU9250_SCK: pixracer_fmu (IC1.30), pixracer_imu (IC4.23 IC5.2 U3.1)
nMAG_CS: pixracer_fmu (IC1.46), pixracer_imu (U3.10)
nMAG_DRDY: pixracer_fmu (IC1.43), pixracer_imu (U3.8)
OTG_FS_DM: pixracer_fmu (IC1.70), pixracer_sd_usb_can_i2c (R6.2)
OTG_FS_DP: pixracer_fmu (IC1.71), pixracer_sd_usb_can_i2c (R7.2)
RC_INPUT: pixracer_fmu (IC1.35), pixracer_serials (IC9.2 R20.1)
RSSI_IN: pixracer_fmu (IC1.16), pixracer_serials (R21.2)
SAFETY_SWITCH_IN: pixracer_fmu (IC1.33), pixracer_serials (J13.1 R40.1)
SBUS_INV: pixracer_fmu (IC1.7), pixracer_serials (IC9.1)
SDIO_CK: pixracer_fmu (IC1.80), pixracer_sd_usb_can_i2c (J4.5)
SDIO_CMD: pixracer_fmu (IC1.83), pixracer_sd_usb_can_i2c (J4.3 R17.2)
SDIO_D0: pixracer_fmu (IC1.65), pixracer_sd_usb_can_i2c (J4.7 R18.2)
SDIO_D1: pixracer_fmu (IC1.66), pixracer_sd_usb_can_i2c (J4.8 R14.1)
SDIO_D2: pixracer_fmu (IC1.78), pixracer_sd_usb_can_i2c (J4.1 R15.2)
SDIO_D3: pixracer_fmu (IC1.79), pixracer_sd_usb_can_i2c (J4.2 R16.2)
SPEKTRUM_POWER: pixracer_fmu (IC1.3), pixracer_power (Q2.1)
VBUS: pixracer_fmu (IC1.68), pixracer_sd_usb_can_i2c (C32.2 J2.1), pixracer_power (D2.2 R42.1 R43.1)
VBUS_VALID: pixracer_fmu (IC1.15), pixracer_power (R42.2)
VDD_3V3_PERIPH: pixracer_serials (JP1.7), pixracer_power (C44.1 C45.1 IC11.5 Q2.2)
VDD_3V3_PERIPH_EN: pixracer_fmu (IC1.34), pixracer_power (IC11.3 R53.1)
VDD_3V3_SENSORS_EN: pixracer_fmu (IC1.2), pixracer_imu (IC7.3 U1.3)
VDD_3V3_SPEKTRUM: pixracer_serials (J6.4), pixracer_power (Q2.3)
VDD_5V_BRICK: pixracer_sd_usb_can_i2c (J3.1 J3.2), pixracer_power (F1.1)
VDD_5V_IN: pixracer_fmu (C14.2 U2.1 U2.3), pixracer_imu (C26.1 C30.2 IC7.1), pixracer_sd_usb_can_i2c (R12.1), pixracer_power (10 pins)
VDD_5V_PERIPH: pixracer_sd_usb_can_i2c (C36.2 IC8.3 J5.1), pixracer_serials (7 pins), pixracer_power (F3.2)
VDD_5V_RECEIVER: pixracer_serials (J6.1), pixracer_power (F2.2)
VDD_5V_SENS: pixracer_fmu (IC1.29), pixracer_sd_usb_can_i2c (R12.2 R13.1)
VDD_BRICK_VALID: pixracer_fmu (IC1.91), pixracer_power (R44.2 R45.1)